# EAGLE design Reflow Panel Rev F (EAGLE 7.6.0)
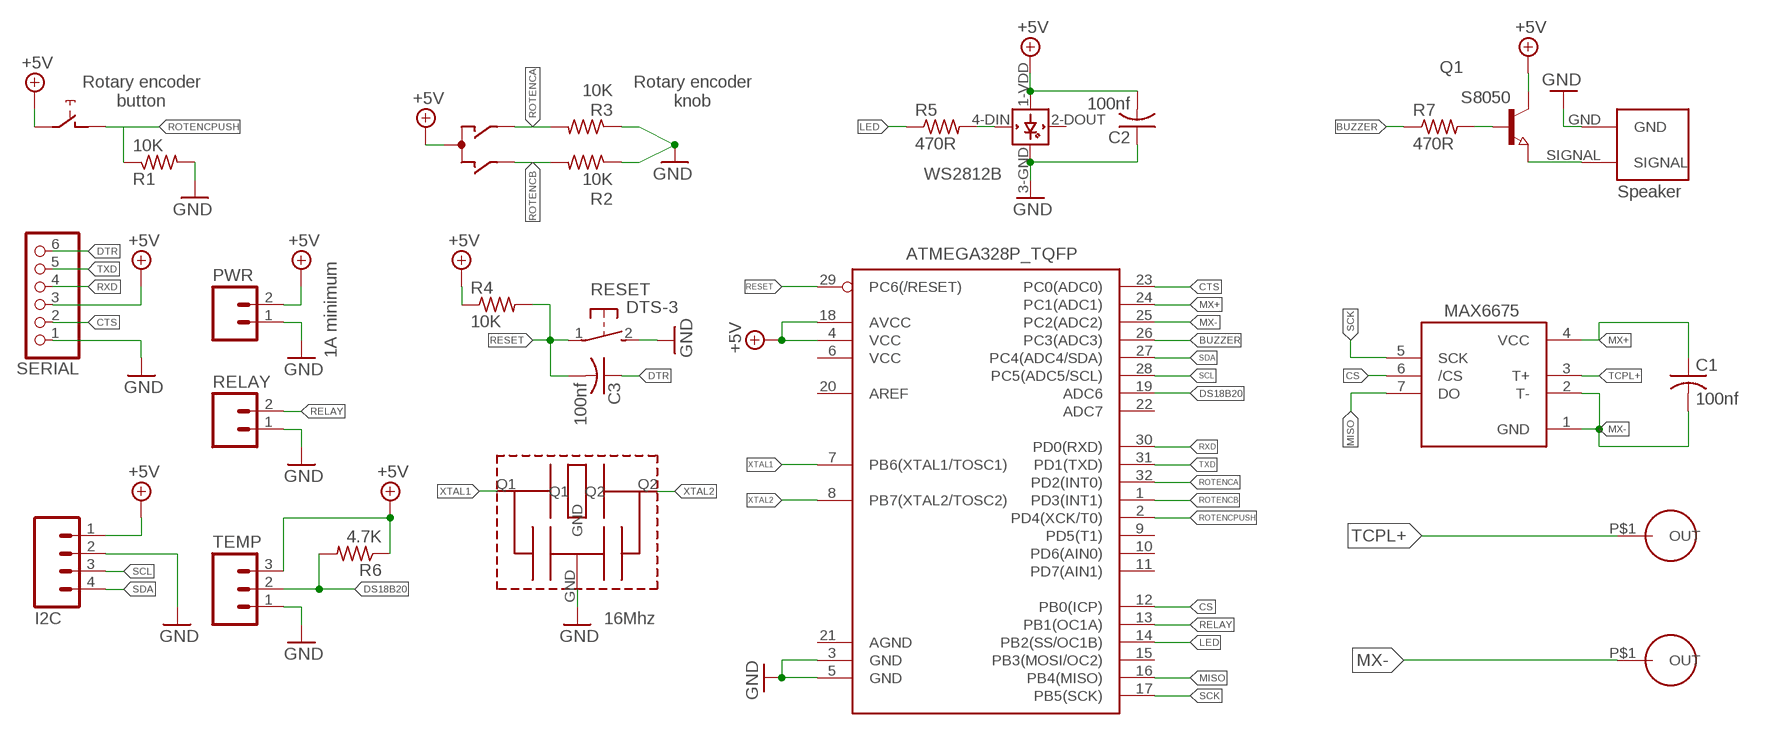
[diagram p0: schematic, sheet 1]

## Parts
C1  100nf  C-USC0805  [C0805]
C2  100nf  C-USC0805  [C0805]
C3  100nf  C-USC0805  [C0805]
I2C  M04LOCK_LONGPADS  [1X04_LOCK_LONGPADS]
IC2  MAX6675  [SO08]
L1  WS2812B_  [WS2812B]
PWR  M02LOCK  [1X02_LOCK]
Q1  NPN-TRANSISTOR_SOT23  [SOT23]
R1  10K  R-US_M0805  [M0805]
R2  10K  R-US_M0805  [M0805]
R3  10K  R-US_M0805  [M0805]
R4  10K  R-US_M0805  [M0805]
R5  470R  R-US_M0805  [M0805]
R6  4.7K  R-US_M0805  [M0805]
R7  470R  R-US_M0805  [M0805]
RELAY  M02LOCK  [1X02_LOCK]
RESET  DTS-3  [DTS-3]
SERIAL  PINHD-1X6LOCK  [1X06-BIGLOCK]
SW1  EC12E_SW  [ALPS_EC12E_SW]
TEMP  M03LOCK  [1X03_LOCK]
U1  ATMEGA328P_TQFP  [TQFP32-08]
U$1  8.5MMSQUAREBUZZER  [8.5MMSQUAREBUZZER]
U$2  CSTCE16M0V53-R0  [CSTCE_V13C]
U$3  BANANAFEMAIL-10.8-5.7  [BANANAFEMALE-10.8-5.7]
U$4  BANANAFEMAIL-10.8-5.7  [BANANAFEMALE-10.8-5.7]

## Nets
+5V: C2.2 I2C.1 L1.1-VDD(VDD) PWR.2 Q1.3(C) R4.1 R6.1 SERIAL.3 SW1.C SW1.E TEMP.3 U1.4(VCC) U1.18(AVCC)
BUZZER: R7.1 U1.26(PC3(ADC3))
CS: IC2.6(/CS) U1.12(PB0(ICP))
CTS: SERIAL.2 U1.23(PC0(ADC0))
DS18B20: R6.2 TEMP.2 U1.19(ADC6)
DTR: C3.1 SERIAL.6
GND: C2.1 I2C.2 L1.3-GND(GND) PWR.1 R1.2 R2.1 R3.1 RELAY.1 RESET.2 SERIAL.1 TEMP.1 U1.3(GND) U1.5(GND) U$1.GND U$2.GND
LED: R5.1 U1.14(PB2(SS/OC1B))
MISO: IC2.7(DO) U1.16(PB4(MISO))
MX+: C1.1 IC2.4(VCC) U1.24(PC1(ADC1))
MX-: C1.2 IC2.1(GND) IC2.2(T-) U1.25(PC2(ADC2)) U$3.P$1(OUT)
N$1: L1.4-DIN(DIN) R5.2
N$2: Q1.2(E) U$1.SIGNAL
N$3: Q1.1(B) R7.2
RELAY: RELAY.2 U1.13(PB1(OC1A))
RESET: C3.2 R4.2 RESET.1 U1.29(PC6(/RESET))
ROTENCA: R3.2 SW1.A U1.32(PD2(INT0))
ROTENCB: R2.2 SW1.B U1.1(PD3(INT1))
ROTENCPUSH: R1.1 SW1.D U1.2(PD4(XCK/T0))
RXD: SERIAL.4 U1.30(PD0(RXD))
SCK: IC2.5(SCK) U1.17(PB5(SCK))
SCL: I2C.3 U1.28(PC5(ADC5/SCL))
SDA: I2C.4 U1.27(PC4(ADC4/SDA))
TCPL+: IC2.3(T+) U$4.P$1(OUT)
TXD: SERIAL.5 U1.31(PD1(TXD))
XTAL1: U1.7(PB6(XTAL1/TOSC1)) U$2.Q1
XTAL2: U1.8(PB7(XTAL2/TOSC2)) U$2.Q2
Unconnected: L1.2-DOUT(DOUT) SW1.GND1(G) SW1.GND2(G) U1.6(VCC) U1.9(PD5(T1)) U1.10(PD6(AIN0)) U1.11(PD7(AIN1)) U1.15(PB3(MOSI/OC2)) U1.20(AREF) U1.21(AGND) U1.22(ADC7)

## Notes on the sheet
- Rotary encoder
  button
- Rotary encoder
  knob
- S8050
- WS2812B
- Speaker
- 1A minimum
- 16Mhz

## Library data of the parts
C1-C3 = rcl:C-US: CAPACITOR, American symbol
I2C = User-Submitted:M04: Header 4 Standard 4-pin 0.1" header. Use with straight break away headers (SKU : PRT-00116), right angle break away headers (PRT-00553), swiss pins (PRT-00743), machine pins (PRT-00117), and female headers (PRT-00115). Molex polarized connector foot print use with SKU : PRT-08231 with associated crimp pins and housings. 1MM SMD Version SKU: PRT-10208
IC2 = adafruit:MAX6675
L1 = adafruit:WS2812B_
PWR RELAY = SparkFun-Connectors:M02: Standard 2-pin 0.1" header. Use with - straight break away headers ( PRT-00116) - right angle break away headers (PRT-00553) - swiss pins (PRT-00743) - machine pins (PRT-00117) - female headers (PRT-00115) Molex polarized connector foot print use with: PRT-08233 with associated crimp pins and housings. 2.54_SCREWTERM for use with PRT-10571. 3.5mm Screw Terminal footprints for PRT-08084 5mm Screw Terminal footprints for use with PRT-08432
Q1 = semicon-smd-ipc:NPN-TRANSISTOR_: NPN TRANSISTOR
R1-R7 = rcl:R-US_: RESISTOR, American symbol
RESET = switch-tact:DTS-3
SERIAL = adafruit:PINHD-1X6: PIN HEADER
SW1 = switch-alps:EC12E_SW: ALPS rotary Encoder EC12E series with switch; MPN: EC12E2424407; OC_FARNELL: 1520813; OC_NEWARK: 74M1068
TEMP = SparkFun-Connectors:M03: Header 3 Standard 3-pin 0.1" header. Use with straight break away headers (SKU : PRT-00116), right angle break away headers (PRT-00553), swiss pins (PRT-00743), machine pins (PRT-00117), and female headers (PRT-00115). Molex polarized connector foot print use with SKU : PRT-08232 with associated crimp pins and housings.
U1 = SparkFun-DigitalIC:ATMEGA328P_TQFP; PROD_ID: IC-09069
U$1 = custom:8.5MMSQUAREBUZZER
U$2 = custom:CSTCE16M0V53-R0
U$3 U$4 = custom:BANANAFEMAIL-10.8-5.7

## Board
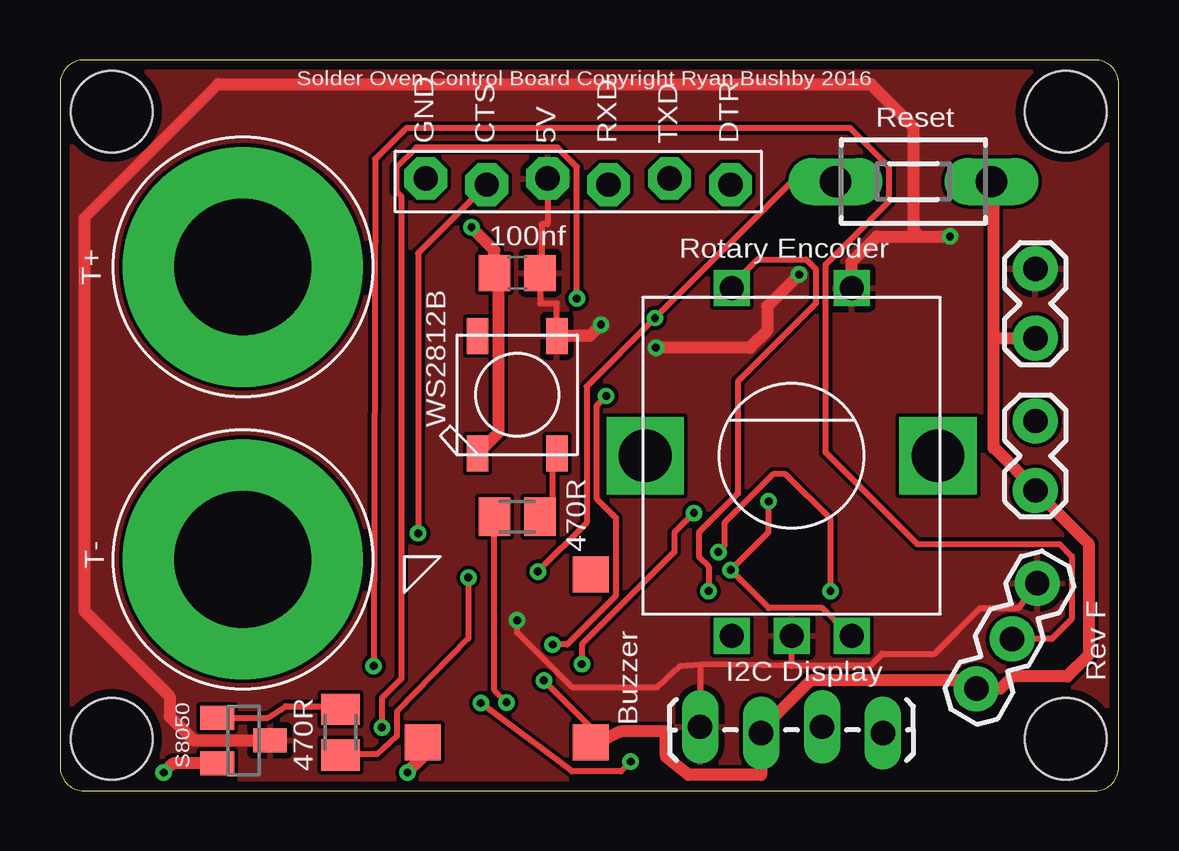
[diagram p1: board, top side]
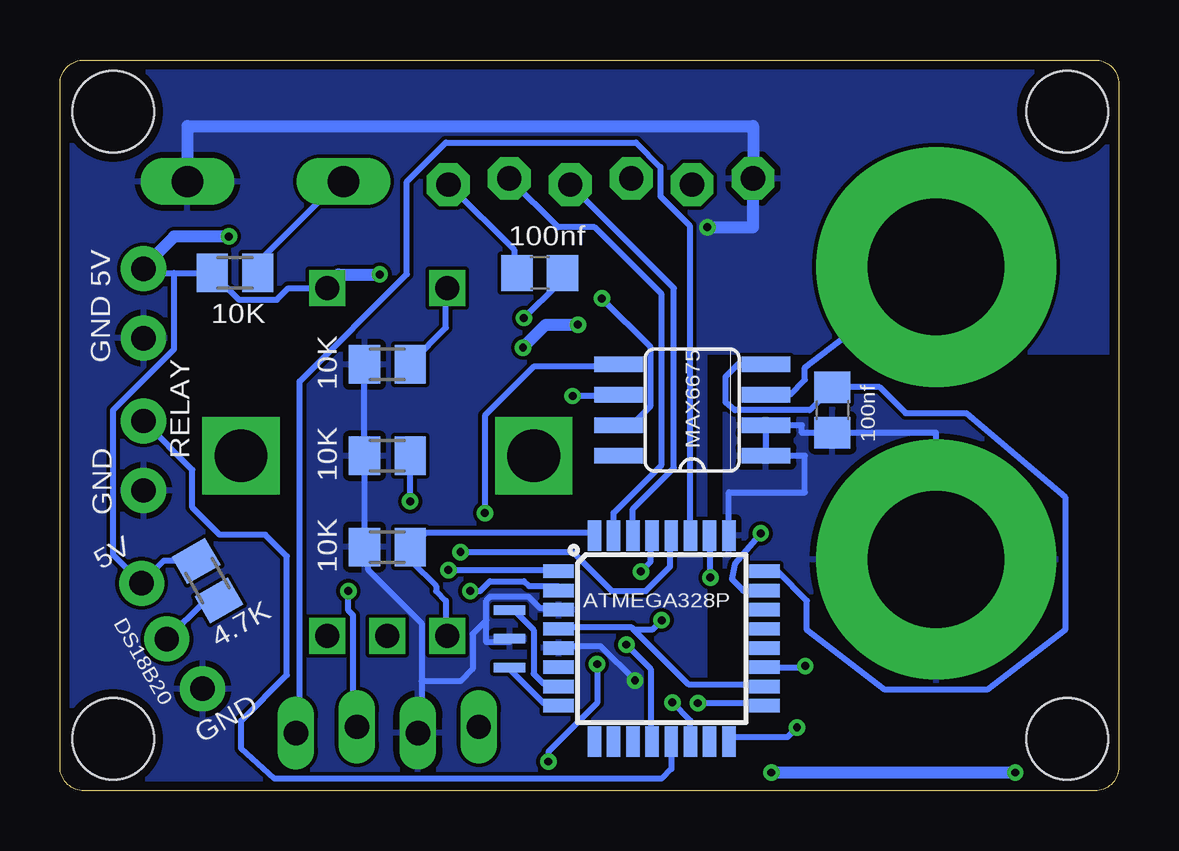
[diagram p2: board, bottom side, seen from below]

Size 44.12 x 30.47 mm. Coordinates in mm from the lower left corner, seen from the top.
Outline: 0,29.47 0,1 arc90 1,0 43.12,0 arc90 44.12,1 44.12,29.47 arc90 43.12,30.47 1,30.47 arc90 0,29.47
Copper layers (1*16): Top 0.0356mm / dielectric 1.5011mm / Bottom 0.0356mm
Design rules "LaenPCBOrder *": minimum track width 10mil, minimum drill 13mil, track to track 6mil, track to pad 6mil, pad to pad 6mil, via to via 6mil, smd to smd 6mil, copper to edge 15mil, drill to drill 6mil, minimum pad ring 7mil, minimum via ring 7mil, stop-mask expansion 3mil, vias tented up to drill 1000mil, thermal gap 10mil
Holes 3.4 mm at 2.16,2.16 2.16,28.32 41.91,28.32 41.91,2.16

### Footprints (pad centres in the part's own frame; a part is rotated, then mirrored left to right if it is on the bottom)
C0805 = smd 1.3 x 1.5: 1 -0.95,0; 2 0.95,0
1X04_LOCK_LONGPADS = drill 1.016 long: 1 0,0; 2 2.54,-0.254; 3 5.08,0; 4 7.62,-0.254
SO08 = smd 0.66 x 2.032: 1 -1.905,-3.073; 2 -0.635,-3.073; 3 0.635,-3.073; 4 1.905,-3.073; 5 1.905,3.073; 6 0.635,3.073; 7 -0.635,3.073; 8 -1.905,3.073
WS2812B = smd 1.5 x 0.9: 1-VDD 2.45,-1.65; 2-DOUT 2.45,1.65; 3-GND -2.45,1.65; 4-DIN -2.45,-1.65
1X02_LOCK = drill 1.016 pad 1.88: 1 -0.178,0; 2 2.718,0
SOT23 = smd 1 x 1.4: 1 -0.95,-1.1; 2 0.95,-1.1; 3 0,1.1
M0805 = smd 1.3 x 1.6: 1 -0.95,0; 2 0.95,0
DTS-3 = drill 1.3 long: 1 -3.25,0; 2 3.25,0
1X06-BIGLOCK = drill 1.016 pad 1.778 octagon: 1 -6.35,0.127; 2 -3.81,-0.127; 3 -1.27,0.127; 4 1.27,-0.127; 5 3.81,0.127; 6 6.35,-0.127
ALPS_EC12E_SW = drill 1 square: A -2.5,-7.5; B 2.5,-7.5; C 0,-7.5; D -2.5,7; E 2.5,7 | drill 2.2 square: GND1 -6.1,0; GND2 6.1,0
1X03_LOCK = drill 1.016 pad 1.88: 1 0,0.127; 2 2.54,-0.127; 3 5.08,0.127
TQFP32-08 = smd 1.27 x 0.559: 1 -4.293,2.8; 2 -4.293,2; 3 -4.293,1.2; 4 -4.293,0.4; 5 -4.293,-0.4; 6 -4.293,-1.2; 7 -4.293,-2; 8 -4.293,-2.8; 17 4.293,-2.8; 18 4.293,-2; 19 4.293,-1.2; 20 4.293,-0.4; 21 4.293,0.4; 22 4.293,1.2; 23 4.293,2; 24 4.293,2.8 | smd 0.559 x 1.27: 9 -2.8,-4.293; 10 -2,-4.293; 11 -1.2,-4.293; 12 -0.4,-4.293; 13 0.4,-4.293; 14 1.2,-4.293; 15 2,-4.293; 16 2.8,-4.293; 25 2.8,4.293; 26 2,4.293; 27 1.2,4.293; 28 0.4,4.293; 29 -0.4,4.293; 30 -1.2,4.293; 31 -2,4.293; 32 -2.8,4.293
8.5MMSQUAREBUZZER = smd 1.5 x 1.5: GND 8.14,0.75; P$3 8.14,7.75; SIGNAL 1.14,0.75
CSTCE_V13C = smd 0.4 x 1.3: GND 0.01,0.01; Q1 -1.19,0.01; Q2 1.21,0.01
BANANAFEMALE-10.8-5.7 = drill 5.7 pad 10: P$1 0,0

### Placement (x,y rotation side)
C1  11.94,15.88 270 bottom
C2  19.05,21.59 0 top
C3  24.13,21.59 0 bottom
I2C  26.67,2.67 0 top
IC2  17.78,15.88 90 bottom
L1  19.05,16.51 90 top
PWR  40.64,19.05 90 top
Q1  7.65,2.1 270 top
R1  30.48,17.78 180 bottom
R2  30.48,13.97 0 bottom
R3  30.48,10.16 0 bottom
R4  36.83,21.59 0 bottom
R5  19.05,11.43 0 top
R6  37.97,8.76 300 bottom
R7  11.68,2.44 90 top
RELAY  40.64,12.7 90 top
RESET  35.56,25.4 0 top
SERIAL  21.59,25.4 0 top
SW1  30.48,13.97 0 top
TEMP  38.29,4.19 60 top
U1  19.05,6.35 0 bottom
U$1  13.97,1.27 0 top
U$2  25.4,6.35 270 bottom
U$3  7.62,9.65 0 top
U$4  7.62,21.84 0 top

### Tracks (layer width: path | path; a pad name or v marks a point on that pad's centre or on a via)
+5V  (via drill 0.33)
  Top 0.254: 20.52,18.9 L1.1-VDD | 26.67,2.54 I2C.1 26.67,5.27 | 20.48,18.89 L1.1-VDD | v19.05,7.11 19.05,6.6 21.34,4.32 24.89,4.32 25.84,5.21 26.67,5.27 | 30.48,5.21 26.67,5.27 | 30.48,5.21 SW1.C | 30.48,5.21 33.75,5.21 34.26,5.71 36.45,5.71 38.35,7.62 39.94,7.62 TEMP.3 | SERIAL.3 20.32,23.62 20.07,23.62 20.07,21.59 C2.2 20,20.32 20.7,20.32 L1.1-VDD
  Top 0.457: 1.02,23.88 6.6,29.46
  Top 0.508: v30.8,21.53 29.46,20.19 29.46,19.18 28.77,18.48 v24.83,18.48 | v22.54,19.43 22.07,18.96 L1.1-VDD | SW1.E 32.98,22.06 34.04,23.11 35.81,23.11 | 35.81,23.11 v37.08,23.11 | 6.6,29.46 33.78,29.46 35.56,27.69 35.56,23.37 35.81,23.11 | 1.02,23.88 1.02,7.49 4.57,3.94 4.57,3.11 5.59,2.1 Q1.3
  Bottom 0.254: 39.37,21.59 40.48,21.59 40.64,21.75 PWR.2 | 39.37,21.59 R4.1 | R4.1 36.67,20.48 35.08,20.48 34.61,20.95 33.08,20.95 33.02,20.95 SW1.E | R4.1 | 20.21,6.71 20.32,6.83 23.34,6.83 U1.4 | 20.21,6.71 17.94,4.45 14.76,4.45 U1.18 | 39.37,21.59 39.37,18.41 41.91,15.88 41.91,9.84 TEMP.3 39.79,9.59 R6.1 | v19.05,7.11 19.45,6.71 20.21,6.71
  Bottom 0.508: 33.08,20.95 32.51,21.53 v30.8,21.53 | v24.83,18.48 23.88,19.43 v22.54,19.43 | v37.08,23.11 39.37,23.11 40.64,21.84
  pour Top: 0,30.48 0,0 44.2,0 44.2,30.48
BUZZER  (via drill 0.33)
  Top 0.254: v17.02,8.89 17.02,6.35 14.03,3.3 14.03,2.29 13.21,1.52 11.59,1.52 R7.1
  Bottom 0.254: U1.26 17.05,8.92 v17.02,8.89
CS  (via drill 0.33)
  Top 0.254: v20.52,6.1 21.13,6.1 23.16,8.13 23.16,11.38 22.35,12.19 22.35,16.05 v22.76,16.46
  Bottom 0.254: v20.52,6.1 19.51,5.08 19.51,2.23 U1.12 | v22.76,16.46 20.93,16.46 IC2.6
CTS  (via drill 0.33)
  Top 0.254: SERIAL.2 14.92,22.42 v14.92,10.73
  Bottom 0.254: v14.92,10.73 16,9.46 16.13,8.83 15.65,8.35 U1.23
DS18B20  (via drill 0.33)
  Top 0.254: v13.07,5.21 13.13,26.34 14.43,27.64 32.92,27.64 34.54,26.01 34.54,24.59 31.9,21.95 31.9,14.1 35.71,10.29 41.66,10.29 42.16,9.78 42.16,7.18 41.32,6.33 TEMP.2
  Bottom 0.254: U1.19 13.12,5.15 v13.07,5.21 | R6.2 38.06,7.94 TEMP.2
DTR
  Bottom 0.254: C3.1 25.2,21.74 25.2,22.55 27.84,25.2 SERIAL.6
GND  (via drill 0.33)
  Top 0.254: v20.16,4.6 22.07,2.7 22.07,2.06 U$1.GND 22.23,1.91 | 17.46,14.13 L1.3-GND | 40.64,12.54 RELAY.1 | 29.21,2.54 I2C.2
  Top 0.508: 22.23,1.91 23.37,2.48 25.24,2.48 25.24,1.43 26.19,0.67 29.21,0.67 I2C.2 | 17.46,14.13 18.26,14.92 18.26,21.59 C2.1 18.1,22.54 v17.14,23.5 | 38.89,18.87 38.89,25.4 RESET.2 | 29.21,2.54 31.27,4.6 37.83,4.6 TEMP.1 39.18,4.25 39.69,4.76 41.97,4.76 42.86,5.65 42.86,10.3 RELAY.1 | 38.89,18.87 PWR.1 | 38.89,18.87 38.89,14.29 38.92,14.29 40.7,12.51
  Bottom 0.254: R2.1 R3.1 31.27,10.16 31.27,9.21 29.05,6.99 29.05,4.57 | R2.1 R1.2 | R2.1 | v20.16,4.6 21.59,6.03 23.34,6.03 U1.5 | U1.3 23.5,7.62 24.13,7.62 24.61,8.1 26.19,8.1 26.35,7.94 26.35,7.11 | 25.4,6.19 26.35,6.19 26.35,7.11 | 29.05,4.57 29.05,2.57 I2C.2 | 26.35,7.11 26.92,6.54 26.92,5.08 27.43,4.57 29.05,4.57
  Bottom 0.508: 38.73,25.4 RESET.2 38.81,27.72 15.24,27.72 SERIAL.1 15.24,23.5 v17.14,23.5
  pour Bottom: 44.2,0 44.2,30.48 0,30.48 0,18.29 17.27,18.29 17.27,0
LED  (via drill 0.33)
  Top 0.254: v18.61,3.68 18.1,4.19 R5.1
  Bottom 0.254: U1.14 17.85,2.93 v18.61,3.68
MISO  (via drill 0.33)
  Top 0.254: v13.41,2.64 13.41,3.86 14.22,4.67 14.22,24.79 14.02,24.99 14.02,26.01 14.83,26.82 20.73,26.82 21.54,26.01 v21.54,20.52
  Bottom 0.254: v13.41,2.64 13.82,2.23 16.05,2.23 U1.16 | v21.54,20.52 19.51,18.49 19.51,16.05 20.32,15.24 IC2.7
MX+
  Bottom 0.254: U1.24 14.63,9.14 14.22,9.14 13.01,7.92 13.01,6.71 9.75,4.22 5.49,4.22 2.23,6.71 2.23,12.24 6.35,15.75 8.89,15.75 9.97,16.82 C1.1 12.89,15.88 16,15.88 16.38,16.19 16.38,17.27 15.88,17.78 IC2.4
MX-
  Bottom 0.254: U1.25 16.25,12.45 13.08,12.45 13.08,13.97 IC2.1 IC2.2 13.21,15.24 13.21,14.93 C1.2 7.62,14.93 U$3.P$1
  pour Bottom: 16.38,-0.13 16.38,17.02 0,17.02 0,-0.13
N$1
  Top 0.254: L1.4-DIN 20.52,14.02 20.52,11.99 20.12,11.58 R5.2
N$2  (via drill 0.33)
  Top 0.508: U$1.SIGNAL 15.11,1.39 v14.48,0.76 | Q1.2 4.7,1.15 v4.32,0.76
  Bottom 0.508: v14.48,0.76 v4.32,0.76
N$3
  Top 0.254: Q1.1 8.66,3.05 9.4,3.52 11.17,3.52 R7.2
RELAY
  Bottom 0.254: U1.13 18.65,0.91 19.05,0.51 35.18,0.51 36.58,1.78 36.58,2.92 34.67,4.83 34.67,9.78 35.56,10.67 37.47,10.67 38.61,11.81 38.61,13.39 RELAY.2
RESET  (via drill 0.33)
  Top 0.254: v19.91,9.14 21.95,11.18 21.95,16.87 v24.79,19.71 30.48,25.4 RESET.1
  Bottom 0.254: v19.91,9.14 19.51,9.55 19.51,10.57 U1.29 | v24.79,19.71 23.37,21.13 23.37,21.54 C3.2 | R4.2 35.76,21.74 35.76,22.15 32.51,25.4 RESET.1
ROTENCA
  Bottom 0.254: 29.46,10.16 28.85,10.77 21.95,10.77 U1.32 | 29.46,10.16 29.46,9.55 28.45,8.53 28.45,8.33 28.04,7.92 28.04,6.5 SW1.A | 29.46,10.16 R3.2
ROTENCB  (via drill 0.33)
  Top 0.254: SW1.B 32.7,6.67 31.75,7.62 29.53,7.62 v27.94,9.21 29.53,10.79 v29.53,12.06
  Bottom 0.254: v27.94,9.21 23.5,9.21 U1.1 | v29.53,12.06 R2.2
ROTENCPUSH  (via drill 0.33)
  Top 0.254: v27.03,8.33 27.03,9.35 26.62,9.75 26.62,10.77 28.25,12.39 28.25,17.07 31.5,20.32 31.5,21.74 31.09,22.15 29.06,22.15 28.04,21.13 SW1.D
  Bottom 0.254: SW1.D 28.04,20.93 28.04,19.3 29.46,17.88 R1.1 | v27.03,8.33 26.62,8.33 26.21,8.74 24.79,8.74 24.59,8.53 23.37,8.53 U1.2
RXD
  Bottom 0.254: U1.30 20.25,11.75 18.54,13.46 18.54,20.95 SERIAL.4
SCK  (via drill 0.33)
  Top 0.254: v23.77,1.22 23.37,0.81 21.34,0.81 v17.54,3.66 | v21.74,5.28 21.74,6.1 25.6,9.96 25.6,10.77 v26.42,11.58
  Bottom 0.254: v23.77,1.22 23.77,1.63 21.74,3.66 v21.74,5.28 | v26.42,11.58 26.42,15.65 24.38,17.68 20.93,17.68 IC2.5 | U1.17 14.83,3.66 v17.54,3.66
SCL  (via drill 0.33)
  Top 0.254: v32.11,8.33 32.11,11.33 30.23,13.21 29.72,13.21 27.69,11.18 27.69,10.21 v27.43,9.96
  Bottom 0.254: v27.43,9.96 22.76,9.96 21.13,8.33 19.71,8.33 18.69,9.35 18.69,10.57 U1.28 | v32.11,8.33 32.11,7.52 31.9,7.32 31.9,2.64 I2C.3
SDA
  Bottom 0.254: U1.27 17.88,10.77 17.88,23.57 19.1,24.79 19.1,26.01 20.12,27.03 28.04,27.03 29.67,25.4 29.67,21.54 34.14,17.07 34.14,2.44 I2C.4
TCPL+
  Bottom 0.254: IC2.3 13.72,16.51 13.08,17.14 13.08,17.65 U$4.P$1
TXD
  Bottom 0.254: U1.31 21.05,11.59 19.05,13.59 19.05,20.7 21.84,23.5 23.37,23.5 SERIAL.5
XTAL1
  Bottom 0.254: U1.7 23.37,4.47 23.98,4.47 24.38,4.88 24.38,6.71 25.2,7.52 U$2.Q1
XTAL2
  Bottom 0.254: U1.8 23.37,3.66 23.98,3.66 25.4,5.08 U$2.Q2

### Text on the board
tPlace: Solder Oven Control Board Copyright Ryan Bushby 2016 | Reset | GND | CTS | 5V | RXD | TXD | DTR | 100nf | T+ | Rotary Encoder | WS2812B | 470R | T- | Buzzer | I2C Display | Rev F | 470R | S8050
bPlace: 100nf | 5V | 10K | 10K | GND | 100nf | 10K | MAX6675 | RELAY | 10K | GND | 5V | ATMEGA328P | DS18B20 | 4.7K | GND